# EAGLE design DC Sensor (EAGLE 5.10)
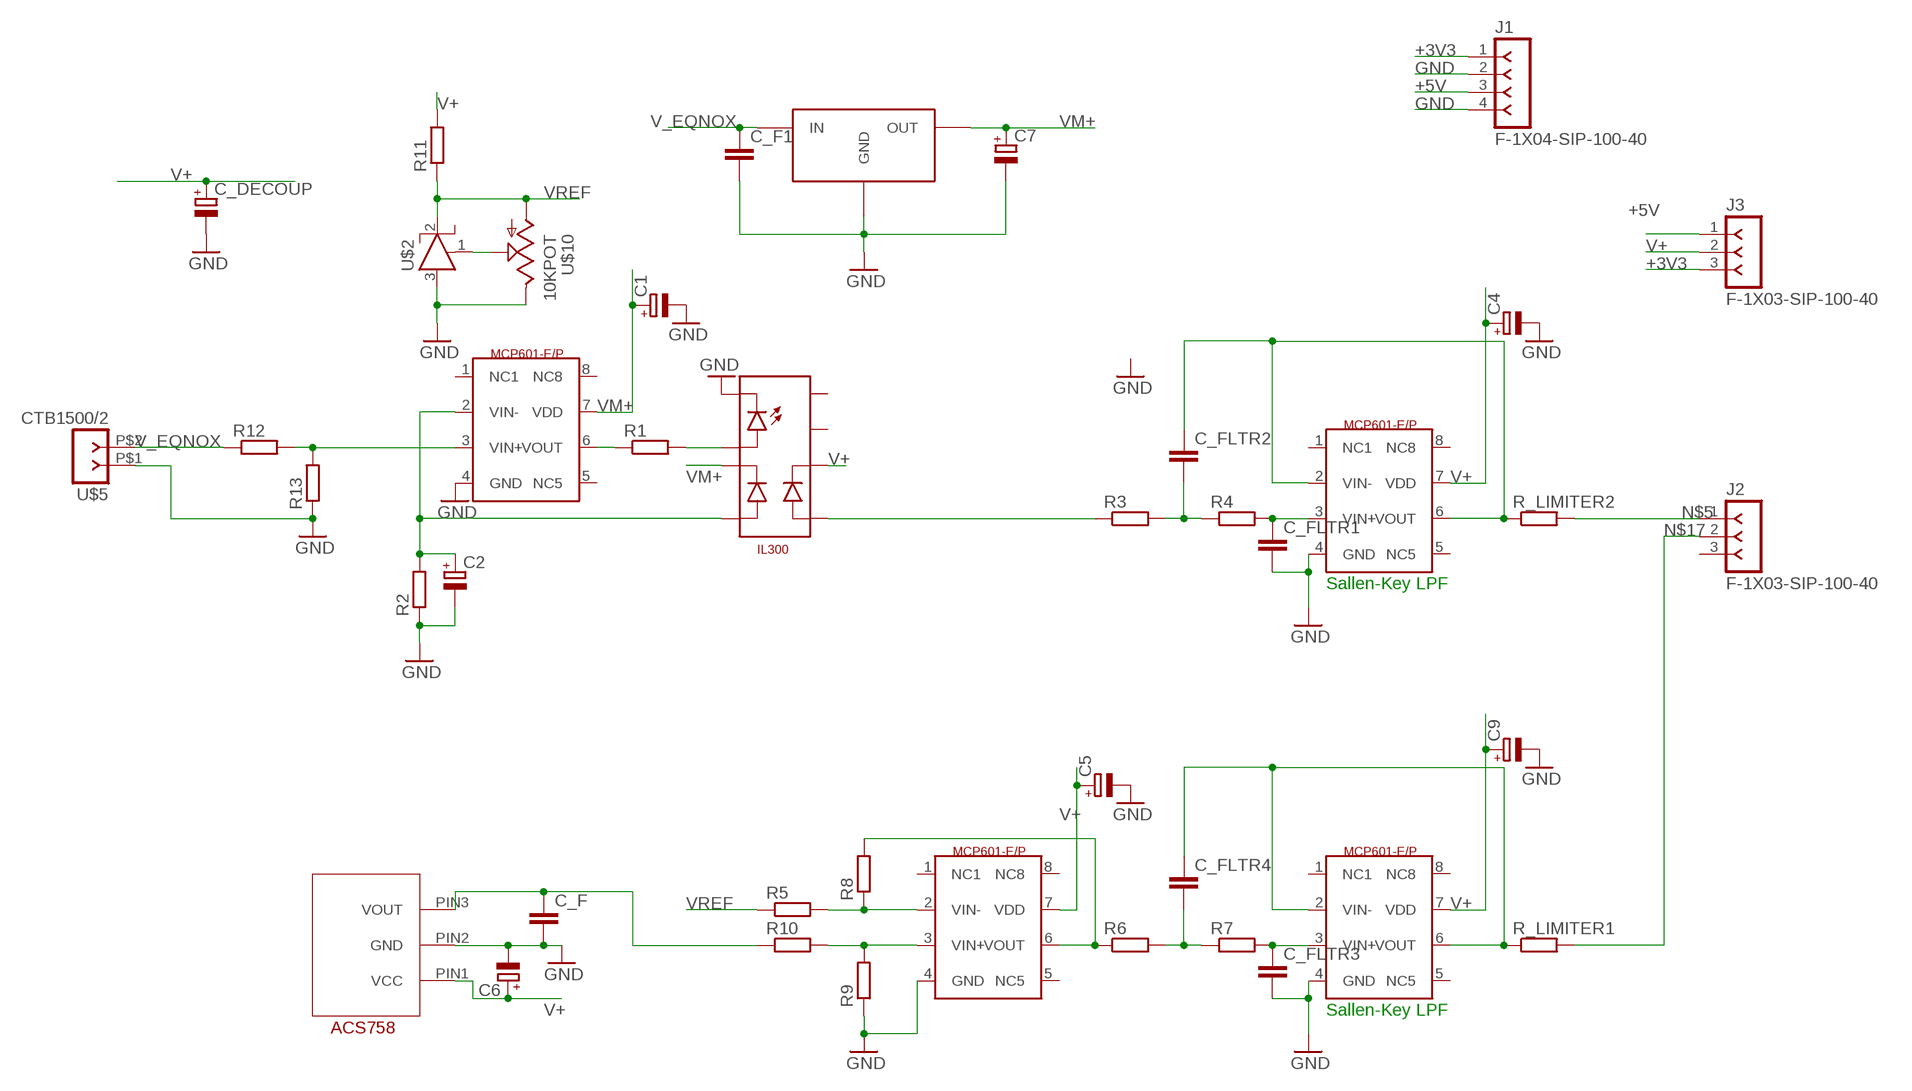
[diagram p0: schematic, sheet 1]

## Parts
C1  CPOL1  [E2,5-7---100UF]
C2  CPOL1  [E2,5-7---100UF]
C4  CPOL1  [E2,5-7---100UF]
C5  CPOL1  [E2,5-7---100UF]
C6  CPOL1  [E2,5-7---100UF]
C7  CPOL1  [E2,5-7---100UF]
C9  CPOL1  [E2,5-7---100UF]
C_DECOUP  CPOL1  [E2,5-7---100UF]
C_F  C5P  [C050-030-075]
C_F1  C5P  [C050-030-075]
C_FLTR1  C5P  [C050-030-075]
C_FLTR2  C5P  [C050-030-075]
C_FLTR3  C5P  [C050-030-075]
C_FLTR4  C5P  [C050-030-075]
J1  F-1X04-SIP-100-40  [SIP-100-04-40]
J2  F-1X03-SIP-100-40  [SIP-100-03-40]
J3  F-1X03-SIP-100-40  [SIP-100-03-40]
R1  R  [0207/10]
R2  R  [0207/10]
R3  R  [0207/10]
R4  R  [0207/10]
R5  R  [0207/10]
R6  R  [0207/10]
R7  R  [0207/10]
R8  R  [0207/10]
R9  R  [0207/10]
R10  R  [0207/10]
R11  R  [0207/10]
R12  R  [0207/10]
R13  R  [0207/10]
R_LIMITER1  R  [0207/10]
R_LIMITER2  R  [0207/10]
U$1  IL300  [PDIP8]
U$2  LT1009  [TO-92]
U$3  MCP601  [PDIP8]
U$4  MCP601  [PDIP8]
U$5  CTB1500/2  [CTB1500-2]
U$6  MCP601  [PDIP8]
U$7  MCP601  [PDIP8]
U$8  ACS758  [ACS758]
U$9  LM2931  [TO-92]
U$10  10KPOT  [10KPOT]

## Nets
+3V3: J1.1 J3.3
+5V: J1.3 J3.1
GND: C1.- C2.- C4.- C5.- C6.- C7.- C9.- C_DECOUP.- C_F1.2 C_F.2 C_FLTR1.2 C_FLTR3.2 J1.2 J1.4 R2.1 R9.1 R13.1 U$1.1(C_LED) U$2.3(A) U$3.4(GND) U$4.4(GND) U$5.P$1 U$6.4(GND) U$7.4(GND) U$8.PIN2(GND) U$9.2(GND) U$10.PIN3
N$1: R1.2 U$1.2(A_LED)
N$2: R1.1 U$3.6(VOUT)
N$3: C2.+ R2.2 U$1.4(A_FB) U$3.2(VIN-)
N$4: R3.1 U$1.5(A_OUT)
N$5: J2.1 R_LIMITER2.2
N$6: C_FLTR2.1 R_LIMITER2.1 U$6.2(VIN-) U$6.6(VOUT)
N$7: C_FLTR2.2 R3.2 R4.1
N$8: C_FLTR1.1 R4.2 U$6.3(VIN+)
N$9: R6.1 R8.2 U$7.6(VOUT)
N$10: R5.2 R8.1 U$7.2(VIN-)
N$11: C_F.1 R10.1 U$8.PIN3(VOUT)
N$12: R12.2 R13.2 U$3.3(VIN+)
N$13: U$2.1(ADJ) U$10.PIN2(WIPER)
N$14: C_FLTR4.1 R_LIMITER1.1 U$4.2(VIN-) U$4.6(VOUT)
N$15: C_FLTR4.2 R6.2 R7.1
N$16: C_FLTR3.1 R7.2 U$4.3(VIN+)
N$17: J2.2 R_LIMITER1.2
N$18: R9.2 R10.2 U$7.3(VIN+)
V+: C4.+ C5.+ C6.+ C9.+ C_DECOUP.+ J3.2 R11.2 U$1.6(C_OUT) U$4.7(VDD) U$6.7(VDD) U$7.7(VDD) U$8.PIN1(VCC)
V_EQNOX: C_F1.1 R12.1 U$5.P$2 U$9.3(IN)
VM+: C1.+ C7.+ U$1.3(C_FB) U$3.7(VDD) U$9.1(OUT)
VREF: R5.1 R11.1 U$2.2(C) U$10.PIN1
Unconnected: J2.3 U$1.7(PIN7) U$1.8(PIN8) U$3.1(NC1) U$3.5(NC5) U$3.8(NC8) U$4.1(NC1) U$4.5(NC5) U$4.8(NC8) U$6.1(NC1) U$6.5(NC5) U$6.8(NC8) U$7.1(NC1) U$7.5(NC5) U$7.8(NC8)

## Notes on the sheet
- Sallen-Key LPF
- Sallen-Key LPF

## Library data of the parts
C1 C2 C4-C7 C9 C_DECOUP = ee2parts:CPOL: Electrolytic (polarised) capacitor
C_F C_F1 C_FLTR1-C_FLTR4 = ee2parts:C: Capacitor
J1 = con-headers-jp:F-1X04-: FEMALE HEADER
J2 J3 = con-headers-jp:F-1X03-: FEMALE HEADER
R1-R13 R_LIMITER1 R_LIMITER2 = ee2parts:R: Resistor
U$1 = Pauls_parts:IL300
U$2 = Pauls_parts:LT1009
U$3 U$4 U$6 U$7 = Pauls_parts:MCP601
U$5 = eko-parts:CTB1500/2
U$8 = Pauls_parts:ACS758
U$9 = Pauls_parts:LM2931
U$10 = Pauls_parts:10KPOT

## Board
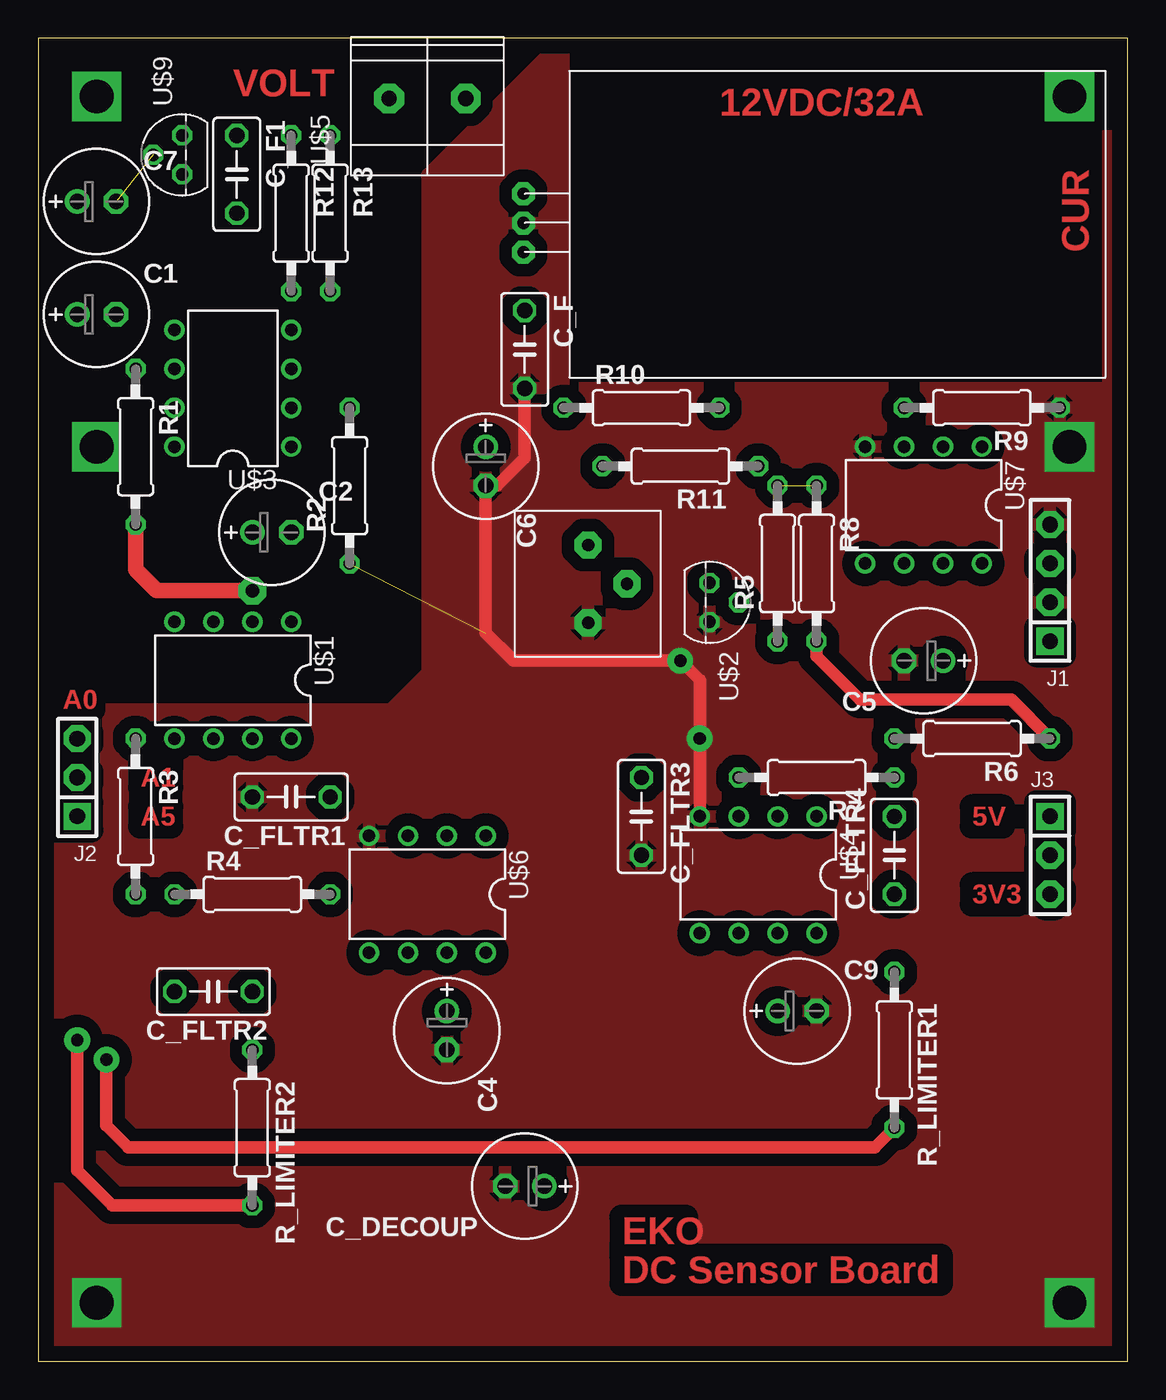
[diagram p1: board, top side]
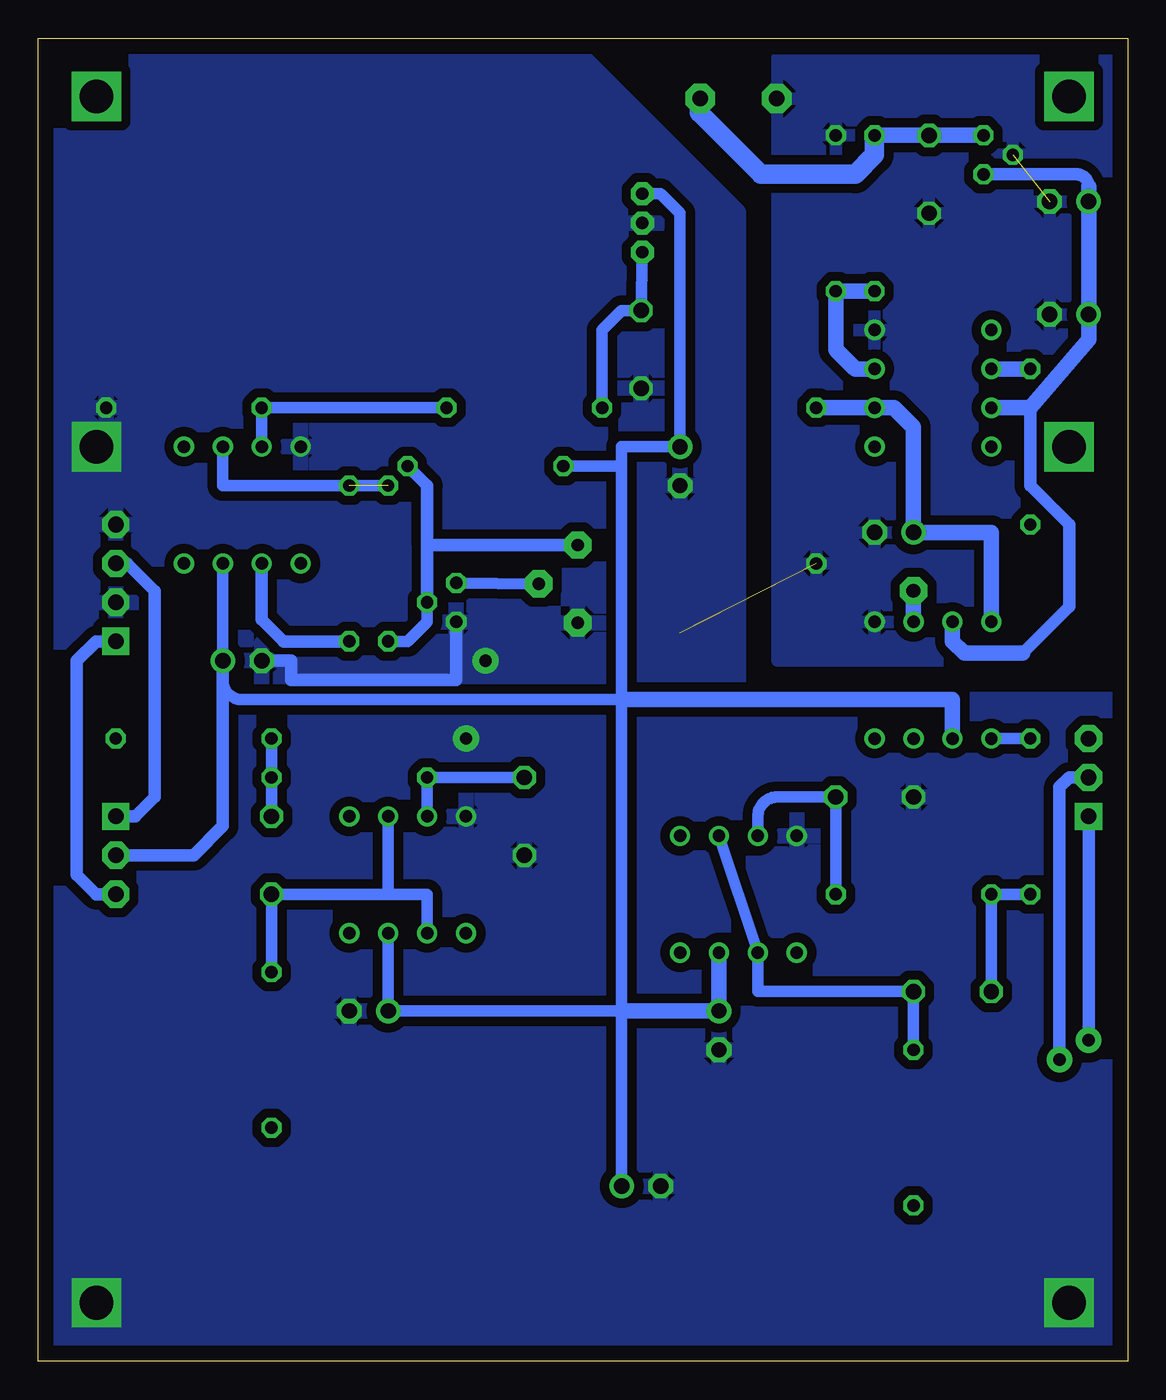
[diagram p2: board, bottom side, seen from below]

Size 71.1 x 86.35 mm. Coordinates in mm from the lower left corner, seen from the top.
Outline: 0,0 71.1,0 71.1,86.35 0,86.35 0,0
Copper layers (1*16): Top 0.035mm / dielectric 1.5mm / Bottom 0.035mm
Design rules "default": minimum track width 10mil, minimum drill 24mil, track to track 8mil, track to pad 8mil, pad to pad 8mil, via to via 8mil, smd to smd 8mil, copper to edge 40mil, drill to drill 8mil, minimum pad ring 10mil, minimum via ring 8mil, stop-mask expansion 4mil, vias tented up to drill 0mil, thermal gap 10mil

### Footprints (pad centres in the part's own frame; a part is rotated, then mirrored left to right if it is on the bottom)
E2,5-7---100UF = drill 1 pad 1.6 round: + -1.27,0 | drill 1 pad 1.6 octagon: - 1.27,0
C050-030-075 = drill 1 octagon: 1 -2.54,0; 2 2.54,0
SIP-100-04-40 = drill 1.016 pad 1.778 square: 1 -3.81,0 | drill 1.016 pad 1.778 octagon: 2 -1.27,0; 3 1.27,0; 4 3.81,0
SIP-100-03-40 = drill 1.016 pad 1.778 square: 1 -2.54,0 | drill 1.016 pad 1.778 octagon: 2 0,0; 3 2.54,0
0207/10 = drill 0.8 octagon: 1 -5.08,0; 2 5.08,0
PDIP8 = drill 0.813 pad 1.27 round: 1 -3.81,-3.81; 2 -1.27,-3.81; 3 1.27,-3.81; 4 3.81,-3.81; 5 3.81,3.81; 6 1.27,3.81; 7 -1.27,3.81; 8 -3.81,3.81
TO-92 = drill 0.8 octagon: 1 -1.27,0; 2 0,1.905; 3 1.27,0
CTB1500-2 = drill 1 pad 1.93 octagon: P$1 -2.5,0.5; P$2 2.5,0.5
ACS758 = drill 0.8 pad 1.5 octagon: PIN1 8,-3; PIN2 9.91,-3; PIN3 11.82,-3
10KPOT = drill 0.8 pad 1.778 octagon: PIN1 7.303,4.75; PIN2 4.763,2.21; PIN3 2.223,4.75

### Placement (x,y rotation side)
C1  3.81,68.33 0 top
C2  15.24,54.1 0 top
C4  26.67,21.59 270 top
C5  57.78,45.72 180 top
C6  29.21,58.42 270 top
C7  3.81,75.69 0 top
C9  49.53,22.86 0 top
C_DECOUP  31.75,11.43 180 top
C_F  31.75,66.04 270 top
C_F1  12.95,77.47 270 top
C_FLTR1  16.51,36.83 180 top
C_FLTR2  11.43,24.13 180 top
C_FLTR3  39.37,35.56 270 top
C_FLTR4  55.88,33.02 90 top
J1  66.04,50.8 90 top
J2  2.54,38.1 90 top
J3  66.04,33.02 270 top
R1  6.35,59.69 270 top
R2  20.32,57.15 90 top
R3  6.35,35.56 270 top
R4  13.97,30.48 0 top
R5  48.26,52.07 90 top
R6  60.96,40.64 180 top
R7  50.8,38.1 180 top
R8  50.8,52.07 270 top
R9  61.59,62.23 180 top
R10  39.37,62.23 0 top
R11  41.91,58.42 180 top
R12  16.51,74.93 270 top
R13  19.05,74.93 270 top
R_LIMITER1  55.88,20.32 270 top
R_LIMITER2  13.97,15.24 270 top
U$1  12.7,44.45 180 top
U$2  43.81,49.53 270 top
U$3  12.7,63.5 90 top
U$4  46.99,31.75 180 top
U$5  25.4,81.92 0 top
U$6  25.4,30.48 180 top
U$7  57.78,55.88 180 top
U$8  34.67,84.2 270 top
U$9  9.4,78.74 90 top
U$10  40.64,45.97 90 top

### Tracks (layer width: path | path; a pad name or v marks a point on that pad's centre or on a via)
+3V3
  Bottom 0.813: J3.3 67.31,30.48 68.58,31.75 68.58,45.72 67.31,46.99 J1.1
+5V
  Bottom 0.813: J1.3 65.3,52.07 63.5,50.27 63.5,36.83 64.77,35.56 J3.1
GND  (via drill 0.8 pad 1.68, 2.2 pad 0.41)  (2 unrouted)
  Top 0.813: C_F.2 31.75,58.95 29.95,57.15 C6.- 29.21,47.52 31.01,45.72 v41.91,45.72 43.18,44.45 v43.18,40.64 U$4.4
  Bottom 0.813: C5.- 54.61,45.72 54.61,44.45 43.81,44.45 U$2.3
  other vias: 67.31,59.69 3.81,3.81 67.31,3.81
  pour Bottom (isolate 0.61): 0,85.09 0,45.72 22.86,45.72 22.86,85.09
  pour Bottom (isolate 0.61): 0,43.18 25.4,43.18 25.4,75 36.76,86.36 71.12,86.36 71.12,0 0,0
  pour Top (isolate 0.813): 71.12,86.36 71.12,0 0,0 0,41.27 1.27,42.55 22.97,42.55 25.4,44.98 25.4,77.47 34.29,86.36 34.29,63.5 69.85,63.5 69.85,86.36
N$1  (via drill 0.9 pad 1.78)
  Top 1.016: R1.2 6.35,51.66 7.72,50.29 v13.97,50.29
  Bottom 1.016: v13.97,50.29 U$1.2
N$2
  Bottom 1.016: R1.1 U$3.6
N$3
  Bottom 1.016: R2.2 U$3.2 15.24,62.23 13.97,60.96 C2.+ 8.89,54.1 U$1.4
N$4
  Bottom 0.762: R3.1 U$1.5
N$5  (via drill 0.8 pad 1.68)
  Top 0.813: R_LIMITER2.2 4.83,10.16 2.54,12.45 v2.54,20.95
  Bottom 0.813: v2.54,20.95 J2.1
N$6
  Bottom 0.762: U$6.2 U$6.6 24.13,24.13 C_FLTR2.1 R_LIMITER2.1
N$7
  Bottom 0.762: R3.2 R4.1 C_FLTR2.2
N$8
  Bottom 0.762: R4.2 C_FLTR1.1 22.86,36.83 arc-90 24.13,35.56 U$6.3
N$9
  Top 0.813: R6.1 63.5,43.18 53.64,43.18 50.8,46.02 R8.2
  Bottom 0.813: R8.2 55.09,46.99 56.52,48.41 U$7.6
N$10  (1 unrouted)
  Bottom 0.762: R5.2 59.05,57.15 U$7.2
N$11
  Bottom 0.762: U$8.PIN3 C_F.1 33.02,68.58 34.29,67.31 R10.1
N$12
  Bottom 1.016: R12.2 R13.2 19.05,66.04 17.78,64.77 U$3.3
N$13
  Bottom 0.762: U$10.PIN2 U$2.1
N$14
  Bottom 0.762: U$4.6 45.72,30.48 48.26,30.48 | 48.26,30.48 U$4.2 | 48.26,30.48 C_FLTR4.1 R_LIMITER1.1
N$15
  Bottom 0.762: R6.2 R7.1 C_FLTR4.2
N$16
  Bottom 0.762: U$4.3 R7.2 C_FLTR3.1
N$17  (via drill 0.8 pad 1.68)
  Top 0.813: R_LIMITER1.2 54.61,13.97 5.87,13.97 4.45,15.39 v4.45,19.68
  Bottom 0.813: v4.45,19.68 4.45,37.47 3.81,38.1 J2.2
N$18
  Bottom 0.762: R10.2 R9.2 U$7.3
N$19  (via drill 2.2 pad 0.41)
  other vias: 67.31,82.55
N$20  (via drill 2.2 pad 0.41)
  other vias: 3.81,59.69
S$4  (via drill 2.2 pad 0.41)
  other vias: 3.81,82.55
V+
  Bottom 0.762: C_DECOUP.+ 33.02,22.86 | 33.02,22.86 33.02,43.18 | 33.02,43.18 33.02,58.42 | 33.02,58.42 33.02,59.69 C6.+ 29.21,74.93 30.48,76.2 U$8.PIN1 | 33.02,58.42 R11.2 | U$7.7 C5.+ 59.05,44.45 arc-90 57.78,43.18 33.02,43.18 | U$4.7 C9.+ 33.02,22.86
  Bottom 0.813: C5.+ 59.05,34.92 60.96,33.02 J3.2
  Bottom 1.016: U$1.6 11.43,43.18 33.02,43.18 | U$6.7 C4.+ 33.02,22.86
V_EQNOX
  Bottom 1.016: U$9.3 C_F1.1 R12.1
  Bottom 1.27: U$5.P$2 27.94,82.42 27.94,81.49 23.92,77.47 17.78,77.47 16.51,78.74 R12.1
VM+
  Bottom 0.813: 6.35,62.23 6.35,57.15 3.81,54.61 3.81,49.27 6.85,46.23 | 2.54,76.67 arc-90 3.34,77.47 U$9.1
  Bottom 1.016: U$1.3 11.43,46.99 10.67,46.23 6.85,46.23 | 2.54,76.67 C7.+ C1.+ 2.54,66.67 6.35,62.23 U$3.7
VREF
  Bottom 0.762: U$2.2 45.72,48.26 46.99,46.99 R5.1
  Bottom 0.813: U$10.PIN1 45.72,53.28 | 45.72,53.28 U$2.2 | 45.72,53.28 45.72,57.15 R11.1

### Text on the board
Top: VOLT | 12VDC/32A | CUR | A0 | A1 | A5 | 5V | 3V3 | EKO | DC Sensor Board